# Altium schematic sheet Ambient_Light.SchDoc: Smart Street Light System - Light Sensor Schematic Doc
size 431 x 279 mm; Author: Arvind Balaji Narayan, Gopik Anand; CompanyName: Cats_and_Dogs; Engineer: Arvind Balaji Narayan, Gopik Anand; Organization: University of Pennsylvania
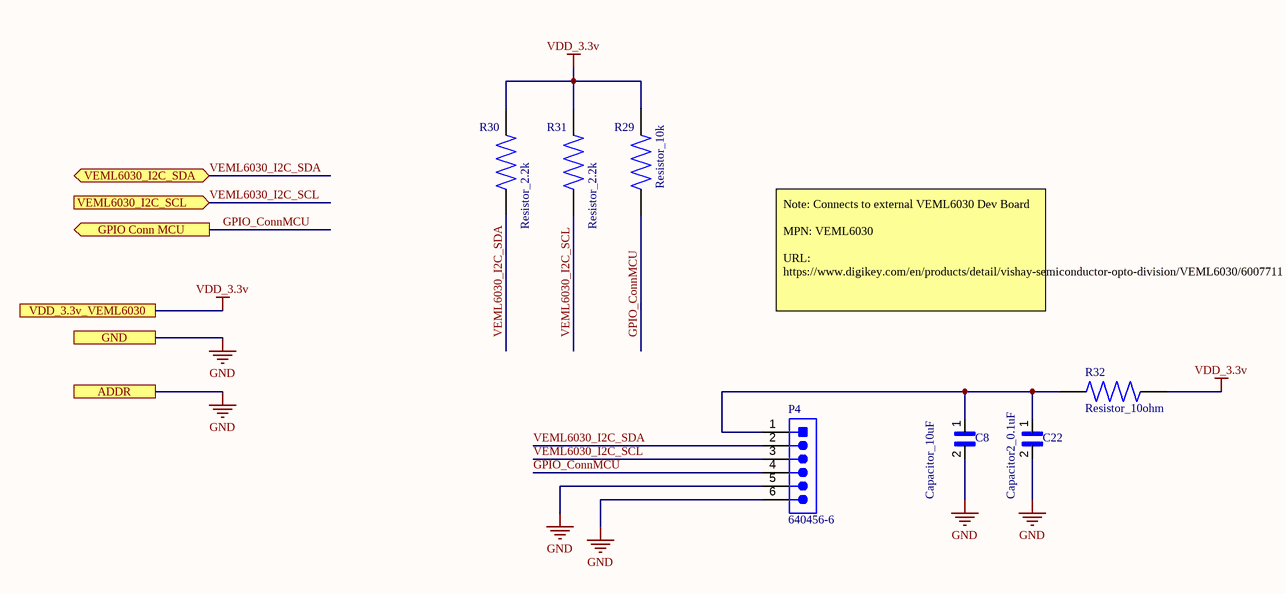
[diagram p0: Ambient_Light.SchDoc]

## Parts
C8  Capacitor_10uF  [Capacitor_10uF]
C22  Capacitor2_0.1uF  [Capacitor2_0.1uF]
P4  640456-6  [TECO-640456-6_V]
R29  Resistor_10k  [Resistor_10k]
R30  Resistor_2.2k  [Resistor_2.2k]
R31  Resistor_2.2k  [Resistor_2.2k]
R32  Resistor_10ohm  [Resistor_10ohm]

## Ports
ADDR, GND, GPIO Conn MCU (out), VDD_3.3v_VEML6030, VEML6030_I2C_SCL (in), VEML6030_I2C_SDA (bidir)

## Nets
GND: C8.2 C22.2 P4.5 P4.6 ; port GND, port ADDR
VDD_3.3v: R29.2 R30.2 R31.2 R32.2 ; port VDD_3.3v_VEML6030
GPIO_ConnMCU: P4.4 R29.1 ; port GPIO Conn MCU
VEML6030_I2C_SCL: P4.3 R31.1 ; port VEML6030_I2C_SCL
VEML6030_I2C_SDA: P4.2 R30.1 ; port VEML6030_I2C_SDA
NetC8_1: C8.1 C22.1 P4.1 R32.1

## Notes on the sheet
- Note: Connects to external VEML6030 Dev Board
  MPN: VEML6030
  URL: https://www.digikey.com/en/products/detail/vishay-semiconductor-opto-division/VEML6030/6007711
- DWG. NO.
- REV.
- SHT.
- THIS DOCUMENT AND THE DATA DISCLOSED HEREIN OR HEREWITH IS THE PROPERTY OF ALTIUM LIMITED AND MAY BE FREELY DISTRIBUTED IN WHOLE. NO RIGHTS ARE RESERVED OR EXPRESS OR IMPLIED WARANTEE GIVEN.
- REVISION
- DESCRIPTION
- DATE
- APPROVED
- ENG:
- APPROVALS
- PROJECT
- DSN:
- CHK:
- REFERENCE DOCUMENTS
- PROJECT REVISION:
- TITLE
- DOCUMENT REVISION:
- DESIGN ITEM:
- BOM:
- FAB DWG:
- PCB DWG:
- ASSY DWG:
- SCALE:
- SIZE
- B
- CAGE CODE
- FILE NAME
- DWG NO.
- SHEET
- OF
- REV

## Library data of the parts
C8 = Capacitor_10uF: 0805 35 V 10 uF ±10% Tolerance X5R Multilayer Ceramic Capacitor
C22 = Capacitor2_0.1uF: Cap Ceramic 0.1uF 16V X5R 10% SMD 0402 85°C Paper T/R; Manufacturer: KEMET; Manufacturer Part Number: C0402C104K4PACTU; Capacitance: 100nF; Dissipation Factor: 5%; Supplier 1: Digi-Key; Supplier Part Number 1: 399-C0402C104K4PAC7867TR-ND; RoHS: Yes; Category: Ceramic Capacitors; Stock 1: 2168149; Pricing 1: 10000=0.00873, 20000=0.00832 (USD); Mount: Surface Mount; Case/Package: 0402; Case Code (Metric): 1005; Case Code (Imperial): 0402; Contact Plating: Tin,Matte; Dielectric Material: Ceramic; Min Operating Temperature: -55°C; Max Operating Temperature: 85°C; Tolerance: 10%; Packaging: Tape and Reel; Voltage Rating: 16V; Package Quantity: 1; Voltage Rating (DC): 16V; Dielectric: X5R; Termination: SMD/SMT; Series: C; Construction: Flat; Length: 1mm; Width: 0.02inch; Height: 0.5mm; Thickness: 0.022inch; Depth: 0.5mm; Radiation Hardening: No; REACH SVHC: No SVHC; Lead Free: Lead Free; RoHS Compliant: Yes; ComponentLink1URL: https://datasheet.ciiva.com/26938/getdatasheetpartid-161478-26938210.pdf?src-supplier=Verical; ComponentLink1Description: https://datasheet.ciiva.com/26938/getdatasheetpartid-161478-26938210.pdf?src-supplier=Verical
P4 = CMP-2000-05661-1: Male Header, Pitch 2.54 mm, 1 x 6 Position, Height 10.03 mm, Tail Length 3.56 mm, -55 to 105 degC, Bulk; Manufacturer: TE Connectivity; Contact Centerline Spacing: 0.100 / in.; Number of Contacts: 6; Current, Rating: 5 / A; Agency Approvals: CSA,UL; Material, Contact: CopperAlloy; Mounting Hole Size: 0.04 / "; Brand/Series: MTA-100Series; Pin Spacing: 0.1 / "; Mount Angle: Vertical; Contact Termination Area Plating: Tin; Angle: Straight; Primary Type: InterconnectSystem; Standards: RoHSCompliant,ELVCompliant,UL94V-0; Temperature, Operating: -55to+105 / °C; Material, Housing: Polyester; Special Features: Pinstrip; Color, Housing: White; Connector Type: MTA-100; Voltage, Rating: 250 / V; Termination: Solder; Package Reference: 640456-6; Size, Post: 0.025 / in.; Color: White; Datasheet URL: https://datasheet.ciiva.com/25618/0900766b80eb7fdd-25618163.pdf; Manufacturer URL: http://www.te.com/; Mounting Type: PCMount; Length, Pin: 0.14 / "; Type: PCBPlug; Length, Overall: 0.6 / "; Mounting Technology: ThroughHole; Number of Rows: 1; Contact Shape: Square; Contact Mating Area Plating: Tin; Datasheet Version: Rev. W, 05/2005; Number of Positions: 6; Package Description: Male Header, Pitch 2.54 mm, 1 x 6 Position, Height 10.03 mm, Tail Length 3.56 mm; Contact Plating: Tin; Length, Terminal Post: 0.14 / in.; Flammability Rating: UL94V-0
R29 = Resistor_10k: Res Thin Film 0805 10K Ohm 1% 1/10W ±50ppm/°C Molded SMD SMD Paper T/R; Manufacturer: TE Connectivity Neohm; Manufacturer Part Number: CPF0805F10KC1; Resistance: 10kR; Max Power Dissipation: 100mW; Number of Resistors: 1; Voltage Rating: 100V; Supplier 1: Mouser; Supplier Part Number 1: 279-CPF0805F10KC1; RoHS: Yes; Category: Chip SMD Resistors; Stock 1: 2893; Pricing 1: 1=0.12000, 10=0.10000, 50=0.10000, 100=0.05400, 1000=0.02200, 10000=0.02200 (USD); Mount: Surface Mount; Case/Package: 0805; Min Operating Temperature: -55°C; Max Operating Temperature: 155°C; Packaging: Tape and Reel; Number of Terminations: 2; Temperature Coefficient: 50ppm/°C; Tolerance: 1%; Series: CPF, Neohm; Power Rating: 100mW; Termination: Solder; RoHS Compliant: Yes; ELV: Compliant; ComponentLink1URL: https://www.te.com/commerce/DocumentDelivery/DDEController?Action=srchrtrv&amp;DocNm=1773200&amp;DocType=DS&amp;DocLang=English&src-supplier=Digi-Key; ComponentLink1Description: https://www.te.com/commerce/DocumentDelivery/DDEController?Action=srchrtrv&amp;DocNm=1773200&amp;DocType=DS&amp;DocLang=English&src-supplier=Digi-Key
R30 R31 = Resistor_2.2k: Res Thick Film 0805 2.2K Ohm 5% 1/3W ±100ppm/°C Molded SMD SMD T/R; Manufacturer: TE Connectivity Holsworthy; Manufacturer Part Number: CRGH0805J2K2; Resistance: 2.2kR; Power Rating: 330mW; Voltage Rating: 150V; Number of Resistors: 1; Supplier 1: Digi-Key; Supplier Part Number 1: A126438CT-ND; RoHS: Yes; Category: Chip SMD Resistors; Stock 1: 10746; Pricing 1: 1=0.10000, 10=0.07200, 100=0.02930, 1000=0.01317, 2500=0.01143 (USD); Mount: Surface Mount; Case/Package: 0805; Case Code (Imperial): 0805; Case Code (Metric): 2012; Min Operating Temperature: -55°C; Max Operating Temperature: 125°C; Tolerance: 5%; Packaging: Tape and Reel; Resistor Type: Thick Film,Power resistor; Temperature Coefficient: 100ppm/°C; Number of Terminations: 2; Series: CRGH; Termination: Solder; Voltage Rating (DC): 150V; Resistance Tolerance: 5%; Technology: THICK FILM; Length: 2mm; Width: 1.25mm; Height: 0.55mm; Depth: 1.25mm; RoHS Compliant: Yes; REACH SVHC: No SVHC; ELV: Compliant; ComponentLink1URL: https://datasheet.ciiva.com/12564/ng-ds-1773204-g-213532-12564996.pdf?src-supplier=Mouser; ComponentLink1Description: https://datasheet.ciiva.com/12564/ng-ds-1773204-g-213532-12564996.pdf?src-supplier=Mouser; ComponentLink2URL: https://datasheet.ciiva.com/22670/1755795-22670438.pdf?src-supplier=Element14; ComponentLink2Description: https://datasheet.ciiva.com/22670/1755795-22670438.pdf?src-supplier=Element14
R32 = Resistor_10ohm: RES TF 1/10W 10 OHM 1% 0603; Manufacturer: Yageo; Manufacturer Part Number: RT0603DRE0710RL; Resistance: 10R; Tolerance: 0.5%; Temperature Coefficient: 50ppm/°C; Max Power Dissipation: 100mW; Voltage Rating (DC): 50V; Supplier 1: Mouser; Supplier Part Number 1: 603-RT0603DRE0710RL; RoHS: Yes; Category: Chip SMD Resistors; Stock 1: 9956; Pricing 1: 1=0.16000, 10=0.10500, 50=0.10500, 100=0.04100, 1000=0.02100, 10000=0.01300 (USD); Case/Package: 0603; Contact Plating: Tin,Matte; Case Code (Metric): 1608; Case Code (Imperial): 0603; Min Operating Temperature: -55°C; Max Operating Temperature: 155°C; Resistor Type: Thin Film; Package Quantity: 5000; Packaging: Tape and Reel; Number of Terminations: 2; Features: Moisture Resistant; Series: RT; Length: 0.063inch; Width: 0.031inch; Height: 0.022inch; Radiation Hardening: No; RoHS Compliant: Yes; Lead Free: Lead Free; ComponentLink1URL: https://datasheet.ciiva.com/8891/pyu-rt-1-to-0-05-rohs-l-4-8891368.pdf?src-supplier=Avnet; ComponentLink1Description: https://datasheet.ciiva.com/8891/pyu-rt-1-to-0-05-rohs-l-4-8891368.pdf?src-supplier=Avnet; ComponentLink2URL: https://datasheet.ciiva.com/2565/pyu-rt-1-to-0-05-rohs-l-5-2565943.pdf?src-supplier=Digi-Key; ComponentLink2Description: https://datasheet.ciiva.com/2565/pyu-rt-1-to-0-05-rohs-l-5-2565943.pdf?src-supplier=Digi-Key; Supplier 2: Digi-Key; Supplier Part Number 2: RMCF0603FT10R0TR-ND; Stock 2: 6764342; Pricing 2: 5000=0.00218 (USD); Mount: Surface Mount; Power Rating: 100mW; Construction: Rectangular; Depth: 0.8mm; Military Standard: Not; ComponentLink3URL: http://components.arrow.com/part/dataview/44988319S6756893N1174?src-supplier=Arrow+Electronics; ComponentLink3Description: http://components.arrow.com/part/dataview/44988319S6756893N1174?src-supplier=Arrow+Electronics; ComponentLink4URL: https://www.seielect.com/catalog/SEI-Packaging.pdf?src-supplier=Digi-Key; ComponentLink4Description: https://www.seielect.com/catalog/SEI-Packaging.pdf?src-supplier=Digi-Key; ComponentLink5URL: https://www.seielect.com/catalog/SEI-RMCF_RMCP.pdf?src-supplier=Avnet; ComponentLink5Description: https://www.seielect.com/catalog/SEI-RMCF_RMCP.pdf?src-supplier=Avnet; ComponentLink6URL: https://www.seielect.com/catalog/SEI-RMCF_RMCP.pdf?src-supplier=Avnet+Asia; ComponentLink6Description: https://www.seielect.com/catalog/SEI-RMCF_RMCP.pdf?src-supplier=Avnet+Asia; ComponentLink7URL: https://www.verical.com/server-webapp/html/getDatasheet?partID=372827&src-supplier=Verical; ComponentLink7Description: https://www.verical.com/server-webapp/html/getDatasheet?partID=372827&src-supplier=Verical